# Altium schematic sheet 3V-Switcher-50mA.SCHDOC
size A4; Organization: UNSW Solar Racing Team; Address3: UNSW; Address4: Sydney NSW 2052; Address2: Electrical Engineering; Address1: Rm 109
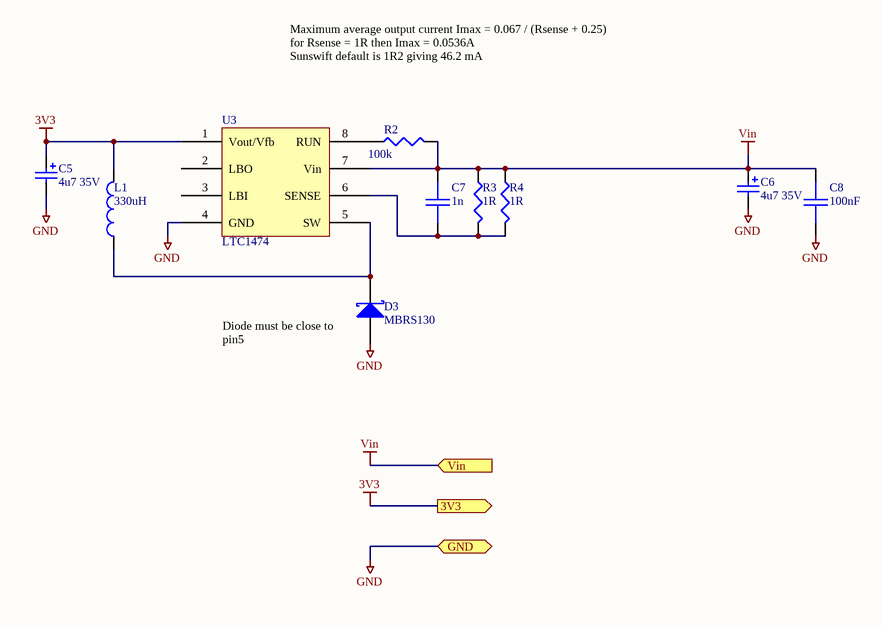
[diagram p0: 3V-Switcher-50mA.SCHDOC]

## Parts
C5  4u7 35V  [MCCT-CASEC]
C6  4u7 35V  [MCCT-CASEC]
C7  1n  [0603]
C8  100nF  [0603]
D3  MBRS130  [SMB]
L1  330uH  [2220]
R2  100k  [0603]
R3  1R  [0603]
R4  1R  [0603]
U3  LTC1474  [TSOP8]

## Ports
3V3, GND (bidir), Vin (in)

## Nets
3V3: C5.1 L1.2 U3.1(Vout/Vfb) ; port 3V3
GND: C5.2 C6.2 C8.2 D3.A U3.4(GND) ; port GND
Vin: C6.1 C7.1 C8.1 R2.2 R3.1 R4.1 U3.7(Vin) ; port Vin
NetC7_2: C7.2 R3.2 R4.2 U3.6(SENSE)
NetD3_K: D3.K L1.1 U3.5(SW)
NetR2_1: R2.1 U3.8(RUN)

Not connected (* = marked no-connect by the designer): U3 2(LBO) 3(LBI)

## Notes on the sheet
- Maximum average output current Imax = 0.067 / (Rsense + 0.25)
  for Rsense = 1R then Imax = 0.0536A
  Sunswift default is 1R2 giving 46.2 mA
- (near D3) Diode must be close to pin5
- Title
- Size:
- Date:
- A4
- Number:
- Time:
- Revision:
- Sheet
- of
- File:

## Library data of the parts
C5 C6 = Cap Pol3: Polarized Capacitor (Surface Mount); Value: 4.7uF; Revision: July-2002: Re-released for DXP Platform.; Farnell: 1565796; Price: 1.5; Digikey: 478-3106-1-ND; DigikeyPrice: 1.13
C7 = CAP: Capacitor; Value: 1nF; Revision: July-2002: Re-released for DXP Platform.; Farnell: 317-202; Price: 0.12
C8 = CAP: Capacitor; Value: 0.1uF; Revision: July-2002: Re-released for DXP Platform.; Farnell: 753-567; Price: 0.13
D3 = D SCHOTTKY: Schottky Diode; Revision: July-2002: Re-released for DXP Platform.; Farnell: 9556931; Price: 0.43; Digikey: MBRS130LT3GOSCT-ND; DigikeyPrice: 0.311
L1 = Inductor: Revision: July-2002: Re-released for DXP Platform.; Value: 330uH; Farnell: 1644442; FarnellPrice: 4.51; Digikey: 495-1762-1-ND; DigikeyPrice: 0.64
R2-R4 = RES1: Resistor
  R2: Value: 100k; Farnell: 9331719; Price: 0.05
  R3 R4: Revision: July-2002: Re-released for DXP Platform.; Value: 1R; Farnell: 9238131; Price: 0.09
U3 = LTC1474: Step-down converter; Farnell: 1273868; Price: 10.00; Digikey: LTC1474CS8-3.3#PBF-ND; DigikeyPrice: 6.88